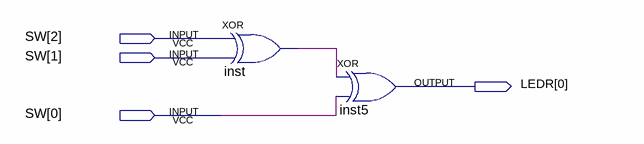
[diagram p0: schematic sheet]
// Quartus schematic tb.bdf as structural Verilog: 2 symbols, 4 pins
module tb (
  input  [2:0] SW,
  output [0:0] LEDR
);

  wire inst_out;

  xor inst (inst_out, SW[2], SW[1]);
  xor inst5 (LEDR[0], inst_out, SW[0]);
endmodule
